# EAGLE schematic main (EAGLE 6.5.0)
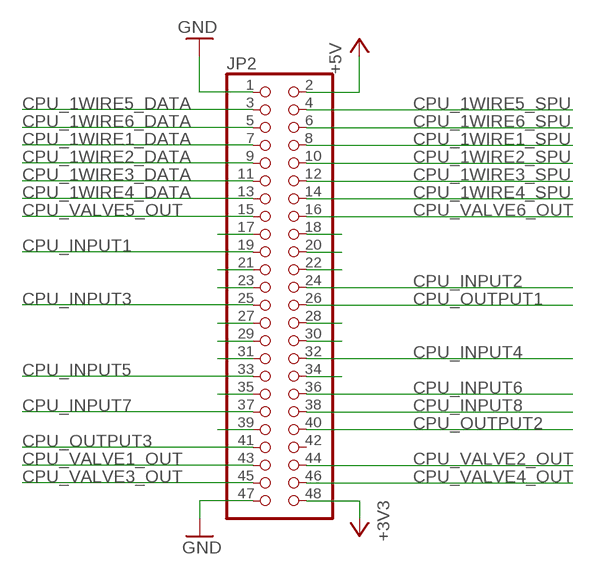
[diagram p0: schematic, sheet 1, part 1 of 3]
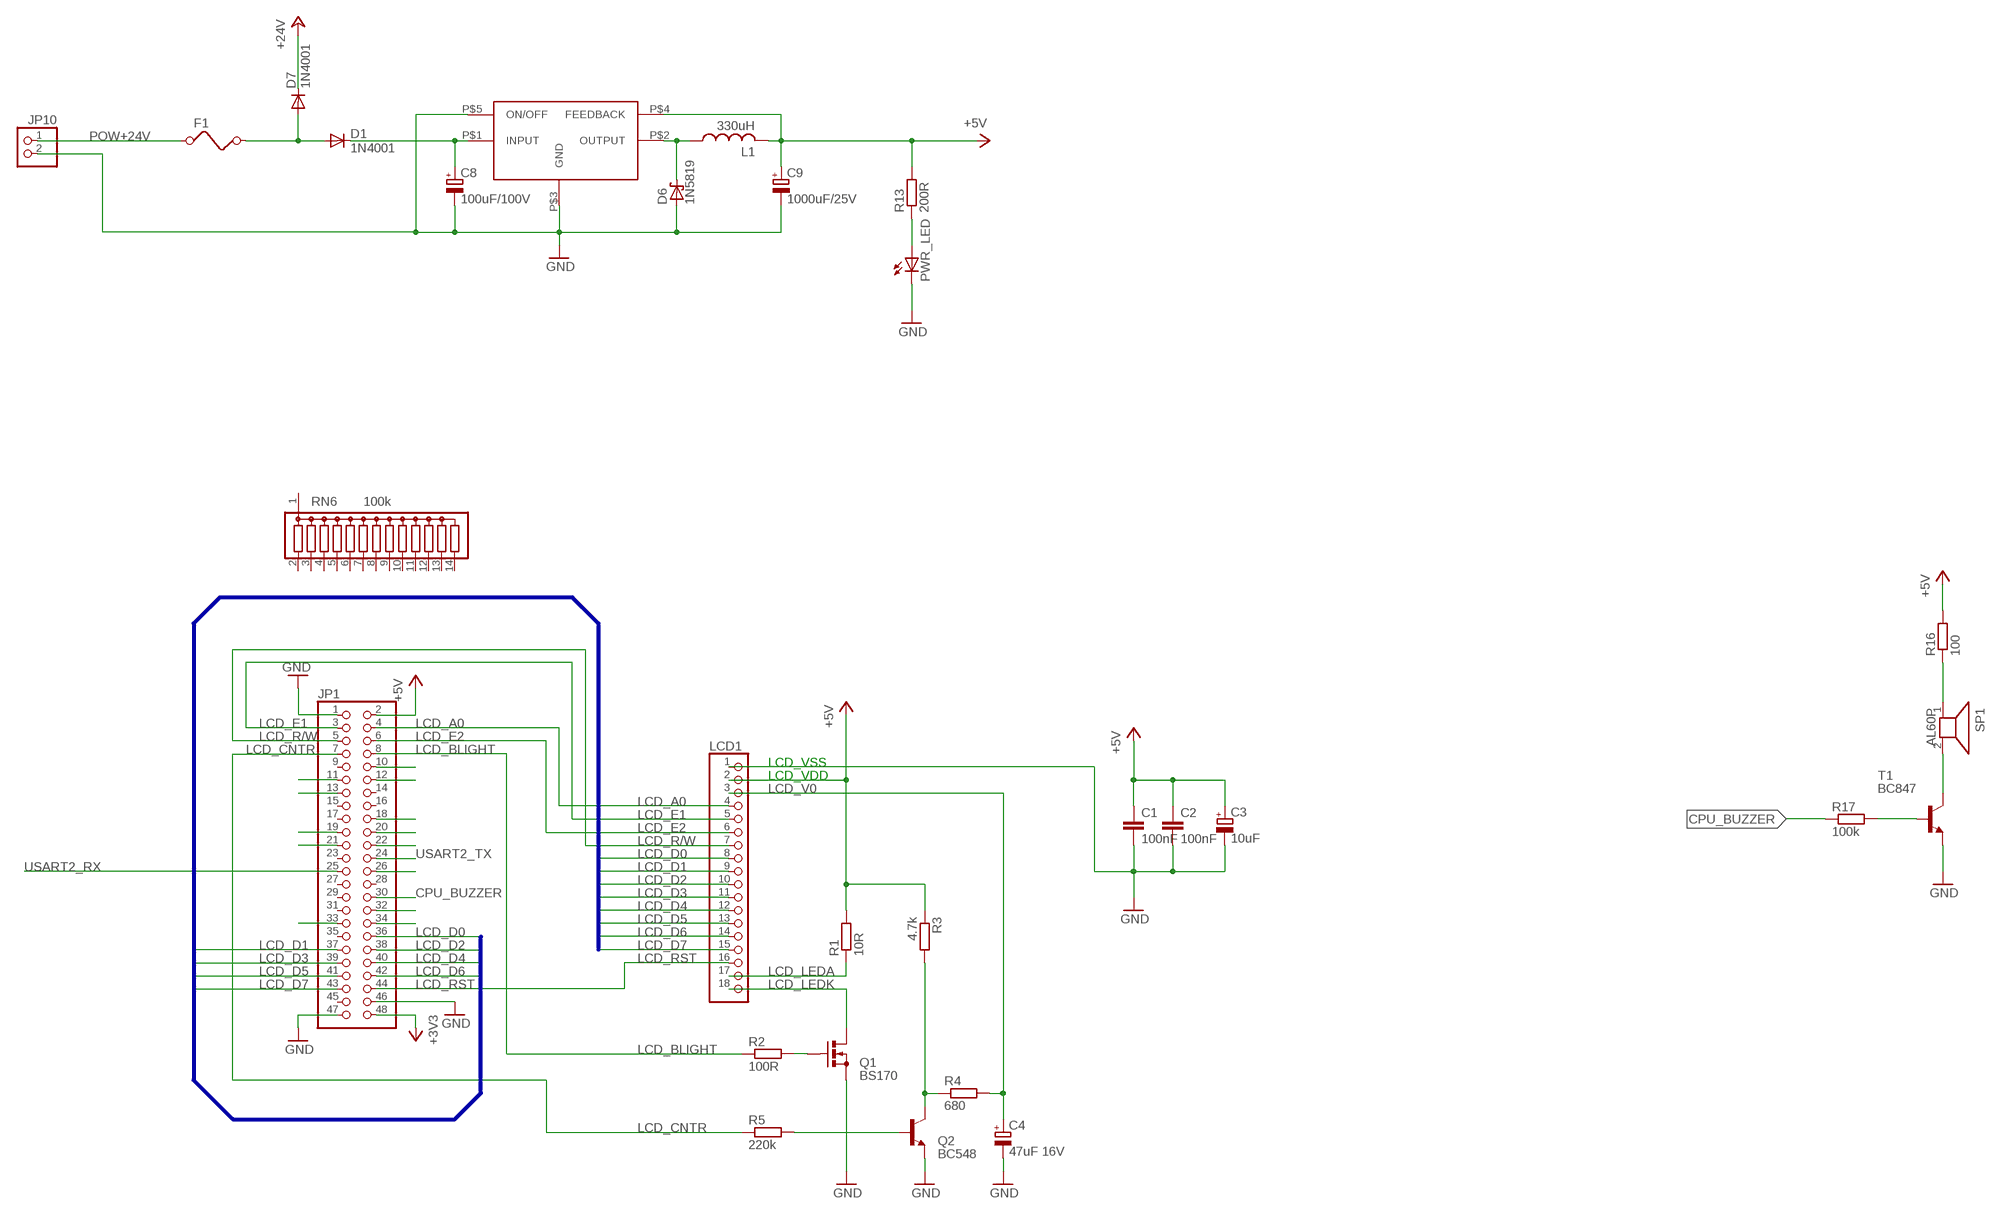
[diagram p1: schematic, sheet 1, part 2 of 3]
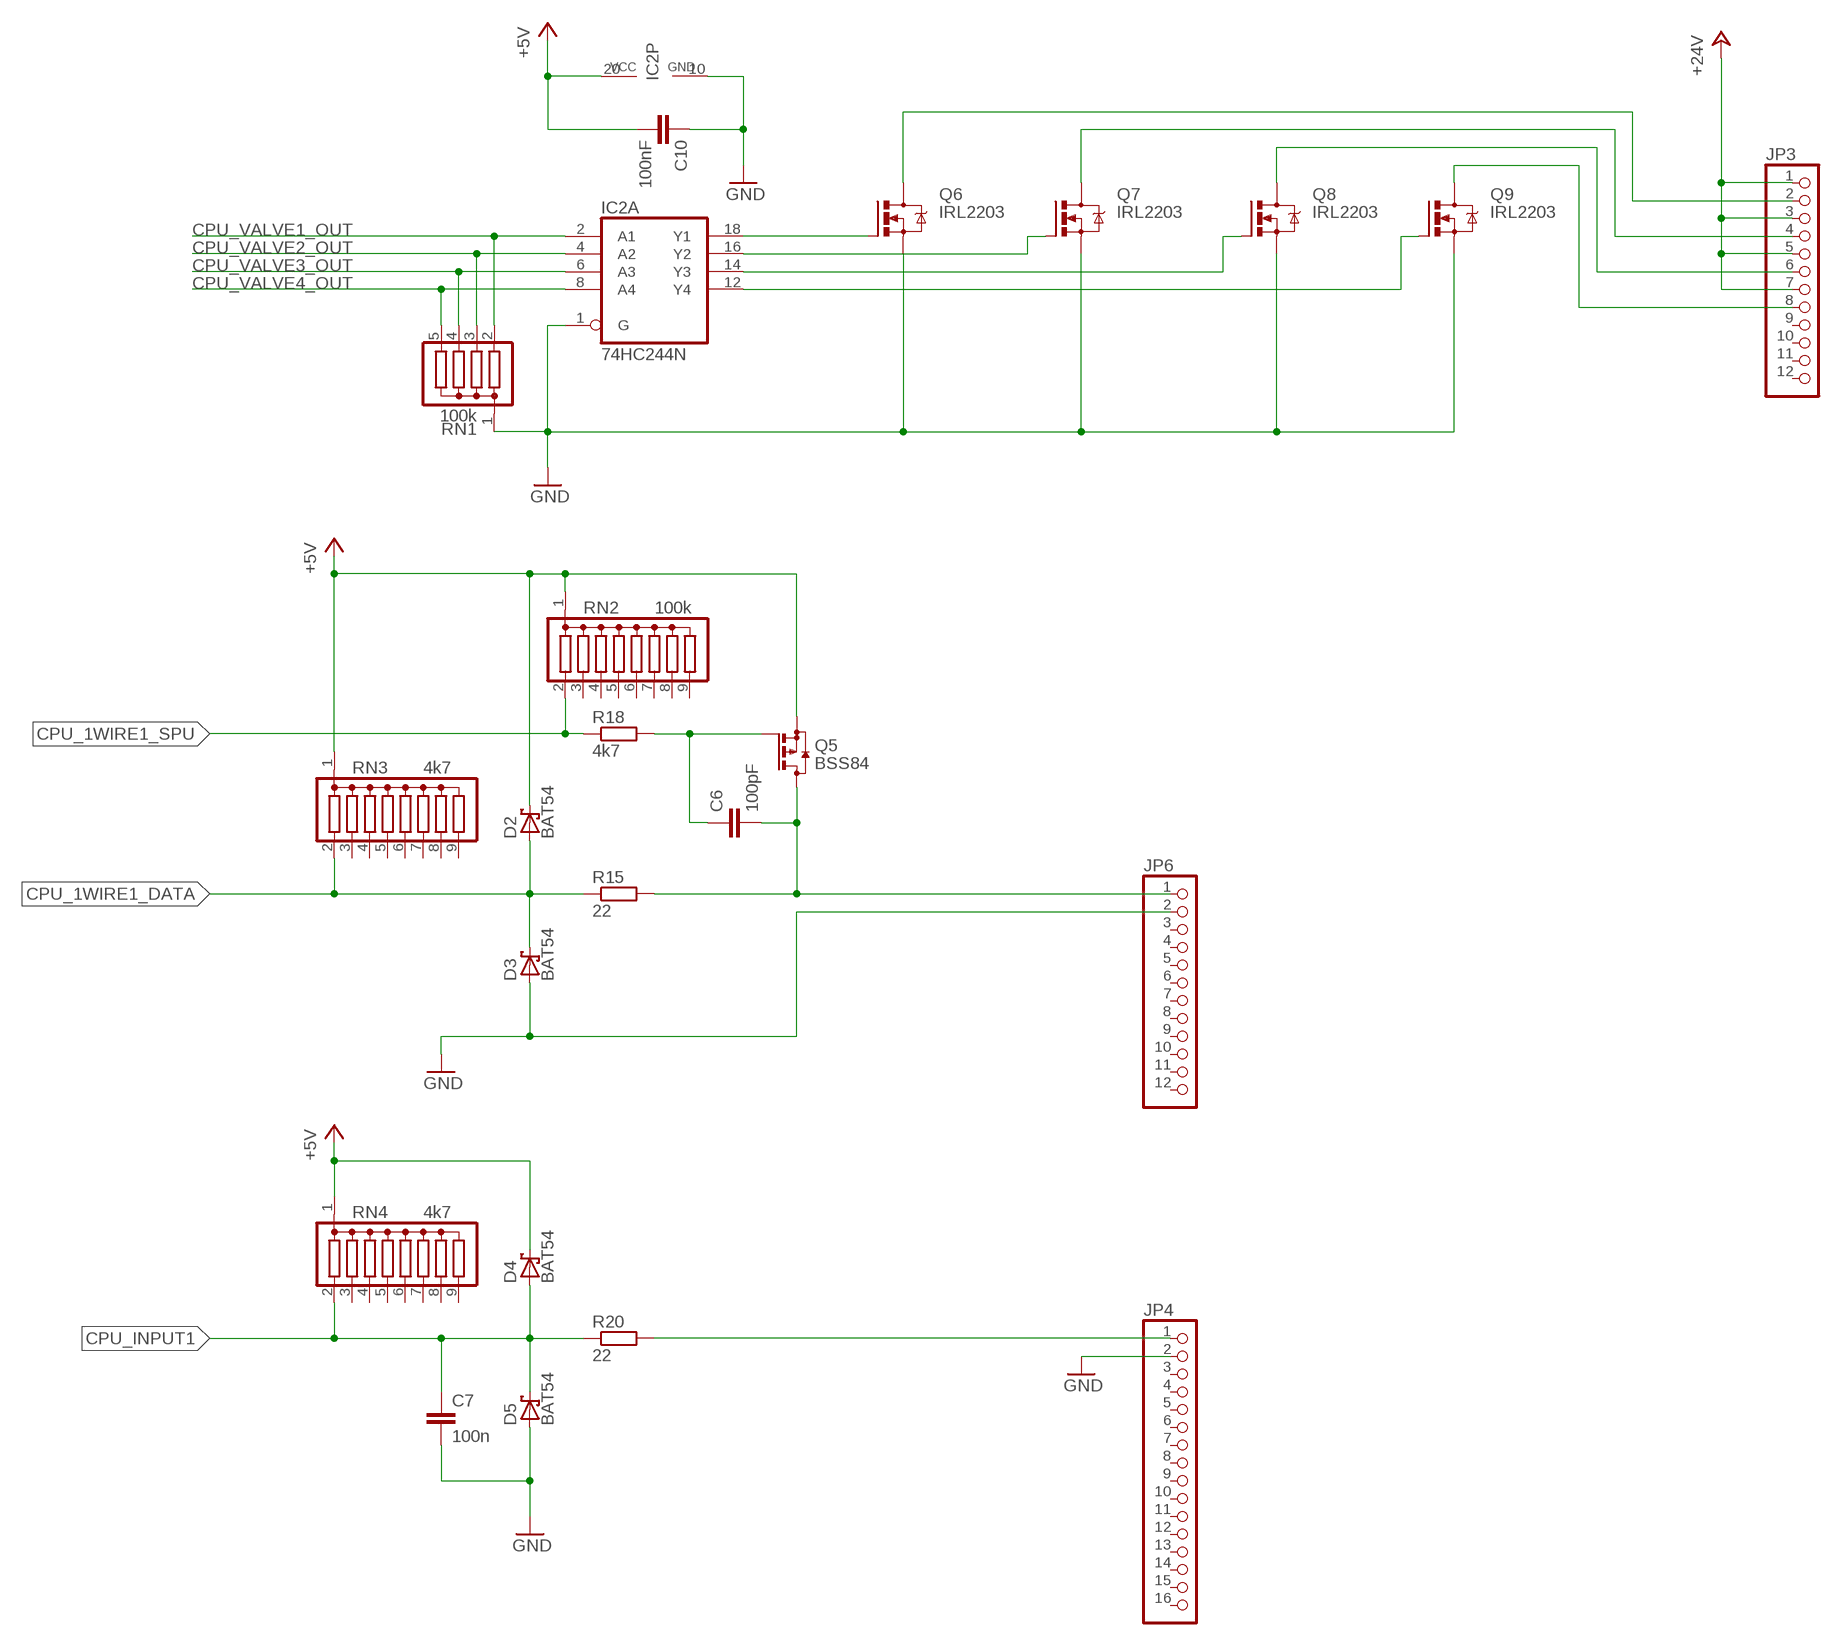
[diagram p2: schematic, sheet 1, part 3 of 3]

## Parts
C1  100nF  C-EU025-024X044  [C025-024X044]
C2  100nF  C-EU025-024X044  [C025-024X044]
C3  10uF  CPOL-EU085CS-1AR  [085CS_1AR]
C4  47uF 16V  CPOL-EU085CS-1AR  [085CS_1AR]
C6  100pF  C-EU025-024X044  [C025-024X044]
C7  100n  C-EU025-024X044  [C025-024X044]
C8  100uF/100V  CPOL-EUE1.8-4  [E1,8-4]
C9  1000uF/25V  CPOL-EUE1.8-4  [E1,8-4]
C10  100nF  C-EU025-024X044  [C025-024X044]
D1  1N4001  1N4004  [DO41-10]
D2  BAT54  [SOT23]
D3  BAT54  [SOT23]
D4  BAT54  [SOT23]
D5  BAT54  [SOT23]
D6  1N5819  BAS40  [SOT23]
D7  1N4001  1N4004  [DO41-10]
F1  FUSE  [FUSE]
IC1  LM2575  [TO-220]
IC2  74HC244N  [DIL20]
JP1  PINHD-2X24  [2X24]
JP2  PINHD-2X24  [2X24]
JP3  PINHD-1X12  [1X12]
JP4  PINHD-1X16  [1X16]
JP6  PINHD-1X12  [1X12]
JP10  PINHD-1X2  [1X02]
L1  330uH  L-US0204/5  [0204/5]
LCD1  PINHD-1X18  [1X18]
PWR_LED  LED  [SMARTLED-TTW]
Q1  BS170  [SOT54E]
Q2  BC548  [TO92-EBC]
Q5  BSS84  [SOT23]
Q6  IRL2203  IRFZ48Z  [TO220BH]
Q7  IRL2203  IRFZ48Z  [TO220BH]
Q8  IRL2203  IRFZ48Z  [TO220BH]
Q9  IRL2203  IRFZ48Z  [TO220BH]
R1  10R  R-EU_0204/2V  [0204V]
R2  100R  R-EU_0204/2V  [0204V]
R3  4.7k  R-EU_0204/2V  [0204V]
R4  680  R-EU_0204/2V  [0204V]
R5  220k  R-EU_0204/2V  [0204V]
R13  200R  R-EU_0204/2V  [0204V]
R15  22  R-EU_0204/2V  [0204V]
R16  100  R-EU_0204/2V  [0204V]
R17  100k  R-EU_0204/2V  [0204V]
R18  4k7  R-EU_0204/2V  [0204V]
R20  22  R-EU_0204/2V  [0204V]
RN1  100k  G04R  [SIL5]
RN2  100k  G08R  [SIL9]
RN3  4k7  G08R  [SIL9]
RN4  4k7  G08R  [SIL9]
RN6  100k  G13R  [SIL14]
SP1  AL60P  [AL60P]
T1  BC847  [SOT23]

## Nets
+3V3: JP1.48 JP2.48
+5V: C1.1 C2.1 C3.+ C9.+ C10.2 D2.3(C) D4.3(C) IC1.P$4(FEEDBACK) IC2.20(P:VCC) JP1.2 JP2.2 L1.2 LCD1.2 Q5.2(S) R1.2 R3.1 R13.2 R16.2 RN2.1 RN3.1 RN4.1
+24V: D7.C JP3.1 JP3.3 JP3.5 JP3.7
?: C6.2 JP6.1 Q5.3(D) R15.2
CPU_1WIRE1_DATA: D2.1(A) D3.3(C) JP2.7 R15.1 RN3.2
CPU_1WIRE1_SPU: JP2.8 R18.1 RN2.2
CPU_1WIRE2_DATA: JP2.9
CPU_1WIRE2_SPU: JP2.10
CPU_1WIRE3_DATA: JP2.11
CPU_1WIRE3_SPU: JP2.12
CPU_1WIRE4_DATA: JP2.13
CPU_1WIRE4_SPU: JP2.14
CPU_1WIRE5_DATA: JP2.3
CPU_1WIRE5_SPU: JP2.4
CPU_1WIRE6_DATA: JP2.5
CPU_1WIRE6_SPU: JP2.6
CPU_BUZZER: JP1.30 R17.1
CPU_INPUT1: C7.1 D4.1(A) D5.3(C) JP2.19 R20.1 RN4.2
CPU_INPUT2: JP2.24
CPU_INPUT3: JP2.25
CPU_INPUT4: JP2.32
CPU_INPUT5: JP2.33
CPU_INPUT6: JP2.36
CPU_INPUT7: JP2.37
CPU_INPUT8: JP2.38
CPU_OUTPUT1: JP2.26
CPU_OUTPUT2: JP2.40
CPU_OUTPUT3: JP2.41
CPU_VALVE1_OUT: IC2.2(A:A1) JP2.43 RN1.2
CPU_VALVE2_OUT: IC2.4(A:A2) JP2.44 RN1.3
CPU_VALVE3_OUT: IC2.6(A:A3) JP2.45 RN1.4
CPU_VALVE4_OUT: IC2.8(A:A4) JP2.46 RN1.5
CPU_VALVE5_OUT: JP2.15
CPU_VALVE6_OUT: JP2.16
GND: C1.2 C2.2 C3.- C4.- C7.2 C8.- C9.- C10.1 D3.1(A) D5.1(A) D6.1(A) IC1.P$3(GND) IC1.P$5(ON/OFF) IC2.1(A:G) IC2.10(P:GND) JP1.1 JP1.46 JP1.47 JP2.1 JP2.47 JP4.2 JP6.2 JP10.2 LCD1.1 PWR_LED.C@1(C) Q1.S Q2.E Q6.S Q7.S Q8.S Q9.S RN1.1 T1.2(E)
LCD_A0: JP1.4 LCD1.4
LCD_BLIGHT: JP1.8 R2.1
LCD_CNTR: JP1.7 R5.1
LCD_D0: JP1.36 LCD1.8
LCD_D1: JP1.37 LCD1.9
LCD_D2: JP1.38 LCD1.10
LCD_D3: JP1.39 LCD1.11
LCD_D4: JP1.40 LCD1.12
LCD_D5: JP1.41 LCD1.13
LCD_D6: JP1.42 LCD1.14
LCD_D7: JP1.43 LCD1.15
LCD_E1: JP1.3 LCD1.5
LCD_E2: JP1.6 LCD1.6
LCD_LEDA: LCD1.17 R1.1
LCD_LEDK: LCD1.18 Q1.D
LCD_R/W: JP1.5 LCD1.7
LCD_RST: JP1.44 LCD1.16
LCD_V0: C4.+ LCD1.3 R4.2
N$1: Q2.C R3.2 R4.1
N$2: Q1.G R2.2
N$3: Q2.B R5.2
N$4: JP3.8 Q9.D
N$5: IC2.16(A:Y2) Q7.G
N$6: JP3.6 Q8.D
N$7: JP3.4 Q7.D
N$8: JP3.2 Q6.D
N$9: JP4.1 R20.2
N$12: C6.1 Q5.1(G) R18.2
N$16: D1.A D7.A F1.2
N$17: SP1.2 T1.3(C)
N$18: C8.+ D1.C IC1.P$1(INPUT)
N$19: IC2.14(A:Y3) Q8.G
N$20: D6.3(C) IC1.P$2(OUTPUT) L1.1
N$21: IC2.18(A:Y1) Q6.G
N$22: PWR_LED.A@1(A) R13.1
N$23: IC2.12(A:Y4) Q9.G
N$24: R16.1 SP1.1
N$25: JP1.10
N$26: R17.2 T1.1(B)
N$27: JP1.12
N$28: JP1.11
N$29: JP1.13
N$30: JP1.19
N$31: JP1.21
N$32: JP1.18
N$33: JP1.20
N$34: JP1.34
N$35: JP1.32
N$36: JP1.33
N$37: JP1.26
POW+24V: F1.1 JP10.1
POWER_CTRL: JP1.22
USART2_RX: JP1.25
USART2_TX: JP1.24
Unconnected: IC2.3(B:Y4) IC2.5(B:Y3) IC2.7(B:Y2) IC2.9(B:Y1) IC2.11(B:A1) IC2.13(B:A2) IC2.15(B:A3) IC2.17(B:A4) IC2.19(B:G) JP1.9 JP1.14 JP1.15 JP1.16 JP1.17 JP1.23 JP1.27 JP1.28 JP1.29 JP1.31 JP1.35 JP1.45 JP2.17 JP2.18 JP2.20 JP2.21 JP2.22 JP2.23 JP2.27 JP2.28 JP2.29 JP2.30 JP2.31 JP2.34 JP2.35 JP2.39 JP2.42 JP3.9 JP3.10 JP3.11 JP3.12 JP4.3 JP4.4 JP4.5 JP4.6 JP4.7 JP4.8 JP4.9 JP4.10 JP4.11 JP4.12 JP4.13 JP4.14 JP4.15 JP4.16 JP6.3 JP6.4 JP6.5 JP6.6 JP6.7 JP6.8 JP6.9 JP6.10 JP6.11 JP6.12 RN2.3 RN2.4 RN2.5 RN2.6 RN2.7 RN2.8 RN2.9 RN3.3 RN3.4 RN3.5 RN3.6 RN3.7 RN3.8 RN3.9 RN4.3 RN4.4 RN4.5 RN4.6 RN4.7 RN4.8 RN4.9 RN6.1 RN6.2 RN6.3 RN6.4 RN6.5 RN6.6 RN6.7 RN6.8 RN6.9 RN6.10 RN6.11 RN6.12 RN6.13 RN6.14

## Buses
B$1

## Notes on the sheet
- LCD_VSS
- LCD_VDD

## Library data of the parts
C1 C2 C6 C7 C10 = rcl:C-EU: CAPACITOR, European symbol
C3 C4 C8 C9 = rcl:CPOL-EU: POLARIZED CAPACITOR, European symbol
D1 D7 = diode:1N4004: DIODE general purpose rectifier, 1 A
D2-D5 = diode:BAT54: Schottky Diodes Source: Fairchild .. BAT54.pdf
D6 = diode:BAS40: Silicon Schottky Diodes General-purpose diode for high-speed switching
F1 = special:FUSE: FUSE 5 x 20 mm
IC1 = eagle:LM2575
IC2 = 74xx-eu:74*244: Octal BUFFER and LINE DRIVER, 3-state
JP1 JP2 = pinhead:PINHD-2X24: PIN HEADER
JP3 JP6 = pinhead:PINHD-1X12: PIN HEADER
JP4 = pinhead:PINHD-1X16: PIN HEADER
JP10 = pinhead:PINHD-1X2: PIN HEADER
L1 = rcl:L-US: INDUCTOR, American symbol
LCD1 = pinhead:PINHD-1X18: PIN HEADER
PWR_LED = led:LED: LED OSRAM: - CHIPLED LG R971, LG N971, LY N971, LG Q971, LY Q971, LO R971, LY R971 LH N974, LH R974 LS Q976, LO Q976, LY Q976 LO Q996 - Hyper CHIPLED LW Q18S LB Q993, LB Q99A, LB R99A - SideLED LS A670, LO A670, LY A670, LG A670, LP A670 LB A673, LV A673, LT A673, LW A673 LH A674 LY A675 LS A676, LA A676, LO A676, LY A676, LW A676 LS A679, LY A679, LG A679 - Hyper Micro SIDELED® LS Y876, LA Y876, LO Y876, LY Y876 LT Y87S - SmartLED LW L88C, LW L88S LB L89C, LB L89S, LG L890 LS L89K, LO L89K, LY L89K LS L896, LA L896, LO L896, LY L896 - TOPLED LS T670, LO T670, LY T670, LG T670, LP T670 LSG T670, LSP T670, LSY T670, LOP T670, LYG T670 LG T671, LOG T671, LSG T671 LB T673, LV T673, LT T673, LW T673 LH T674 LS T676, LA T676, LO T676, LY T676, LB T676, LH T676, LSB T676, LW T676 LB T67C, LV T67C, LT T67C, LS T67K, LO T67K, LY T67K, LW E67C LS E67B, LA E67B, LO E67B, LY E67B, LB E67C, LV E67C, LT E67C LW T67C LS T679, LY T679, LG T679 LS T770, LO T770, LY T770, LG T770, LP T770 LB T773, LV T773, LT T773, LW T773 LH T774 LS E675, LA E675, LY E675, LS T675 LS T776, LA T776, LO T776, LY T776, LB T776 LHGB T686 LT T68C, LB T68C - Hyper Mini TOPLED® LB M676 - Mini TOPLED Santana® LG M470 LS M47K, LO M47K, LY M47K Source: http://www.osram.convergy.de LUXEON: - LUMILED® LXK2-PW12-R00, LXK2-PW12-S00, LXK2-PW14-U00, LXK2-PW14-V00 LXK2-PM12-R00, LXK2-PM12-S00, LXK2-PM14-U00 LXK2-PE12-Q00, LXK2-PE12-R00, LXK2-PE12-S00, LXK2-PE14-T00, LXK2-PE14-U00 LXK2-PB12-K00, LXK2-PB12-L00, LXK2-PB12-M00, LXK2-PB14-N00, LXK2-PB14-P00, LXK2-PB14-Q00 LXK2-PR12-L00, LXK2-PR12-M00, LXK2-PR14-Q00, LXK2-PR14-R00 LXK2-PD12-Q00, LXK2-PD12-R00, LXK2-PD12-S00 LXK2-PH12-R00, LXK2-PH12-S00 LXK2-PL12-P00, LXK2-PL12-Q00, LXK2-PL12-R00 Source: www.luxeon.com KINGBRIGHT: KA-3528ASYC Source: www.kingbright.com
Q1 = transistor-small-signal:BS170: N-CHANNEL MOS FET
Q2 = transistor-npn:BC548*: NPN Transistor
Q5 = transistor-small-signal:BSS84: P-CHANNEL MOS FET
Q6-Q9 = transistor-power:IRFZ48: N Channel HEXFET® Power MOSFET Logic Level Source: http://www.irf.com/product-info/datasheets/data/irfz48z.pdf
R1-R5 R13 R15-R18 R20 = rcl:R-EU_: RESISTOR, European symbol
RN1 = resistor-sil:G04R: SIL RESISTOR; OC_FARNELL: unknown; OC_NEWARK: unknown
RN2-RN4 = resistor-sil:G08R: SIL RESISTOR; OC_FARNELL: unknown; OC_NEWARK: unknown
RN6 = resistor-sil:G13R: SIL RESISTOR; OC_FARNELL: unknown; OC_NEWARK: unknown
SP1 = buzzer:AL60P: SPEAKER Source: Buerklin; OC_FARNELL: unknown; OC_NEWARK: unknown
T1 = transistor:BC847: NPN TRANSISTOR